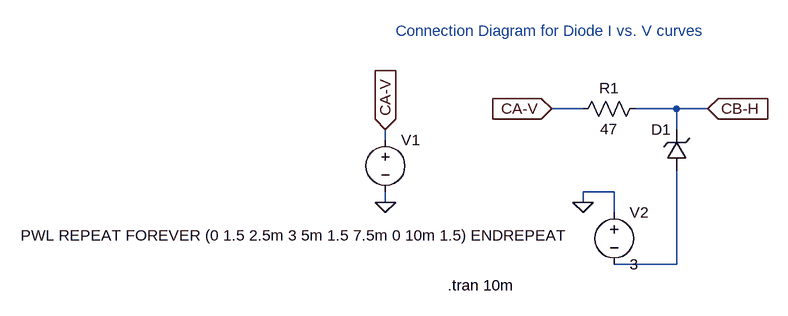
[diagram p0: schematic zener_diode_conn_i_vs_v_ltspice.asc]
zener_diode_conn_i_vs_v_ltspice.asc, the LTspice schematic file:
Version 4
SHEET 1 880 680
WIRE 96 144 48 144
WIRE 240 144 176 144
WIRE 288 144 240 144
WIRE 240 176 240 144
WIRE -208 192 -208 176
WIRE 144 272 96 272
WIRE -208 288 -208 272
WIRE 96 288 96 272
WIRE 144 304 144 272
WIRE 240 384 240 240
WIRE 240 384 144 384
FLAG 48 144 CA-V
IOPIN 48 144 In
FLAG 288 144 CB-H
IOPIN 288 144 In
FLAG -208 288 0
FLAG -208 176 CA-V
IOPIN -208 176 In
FLAG 96 288 0
SYMBOL res 192 128 R90
WINDOW 0 0 56 VBottom 2
WINDOW 3 32 56 VTop 2
SYMATTR InstName R1
SYMATTR Value 47
SYMBOL voltage -208 176 R0
WINDOW 3 -561 163 Left 2
WINDOW 123 0 0 Left 0
WINDOW 39 0 0 Left 0
SYMATTR Value PWL REPEAT FOREVER (0 1.5 2.5m 3 5m 1.5 7.5m 0 10m 1.5) ENDREPEAT
SYMATTR InstName V1
SYMBOL voltage 144 288 R0
WINDOW 123 0 0 Left 0
WINDOW 39 0 0 Left 0
SYMATTR InstName V2
SYMATTR Value 3
SYMBOL zener 256 240 R180
WINDOW 0 24 64 Left 2
WINDOW 3 24 0 Invisible 2
SYMATTR InstName D1
SYMATTR Value 1N750
TEXT -112 416 Left 2 !.tran 10m
TEXT -192 24 Left 2 ;Connection Diagram for Diode I vs. V curves

The netlist it stands for:
* zener_diode_conn_i_vs_v_ltspice.asc
R1 CB-H CA-V 47
V1 CA-V 0 PWL REPEAT FOREVER (0 1.5 2.5m 3 5m 1.5 7.5m 0 10m 1.5) ENDREPEAT
V2 0 N001 3
D1 N001 CB-H 1N750
.model D D
.lib standard.dio
.tran 10m
* Connection Diagram for Diode I vs. V curves
.backanno
.end